# Altium schematic sheet Sheet1.SchDoc
size 431 x 279 mm; SheetNumber: 1; SheetTotal: 1
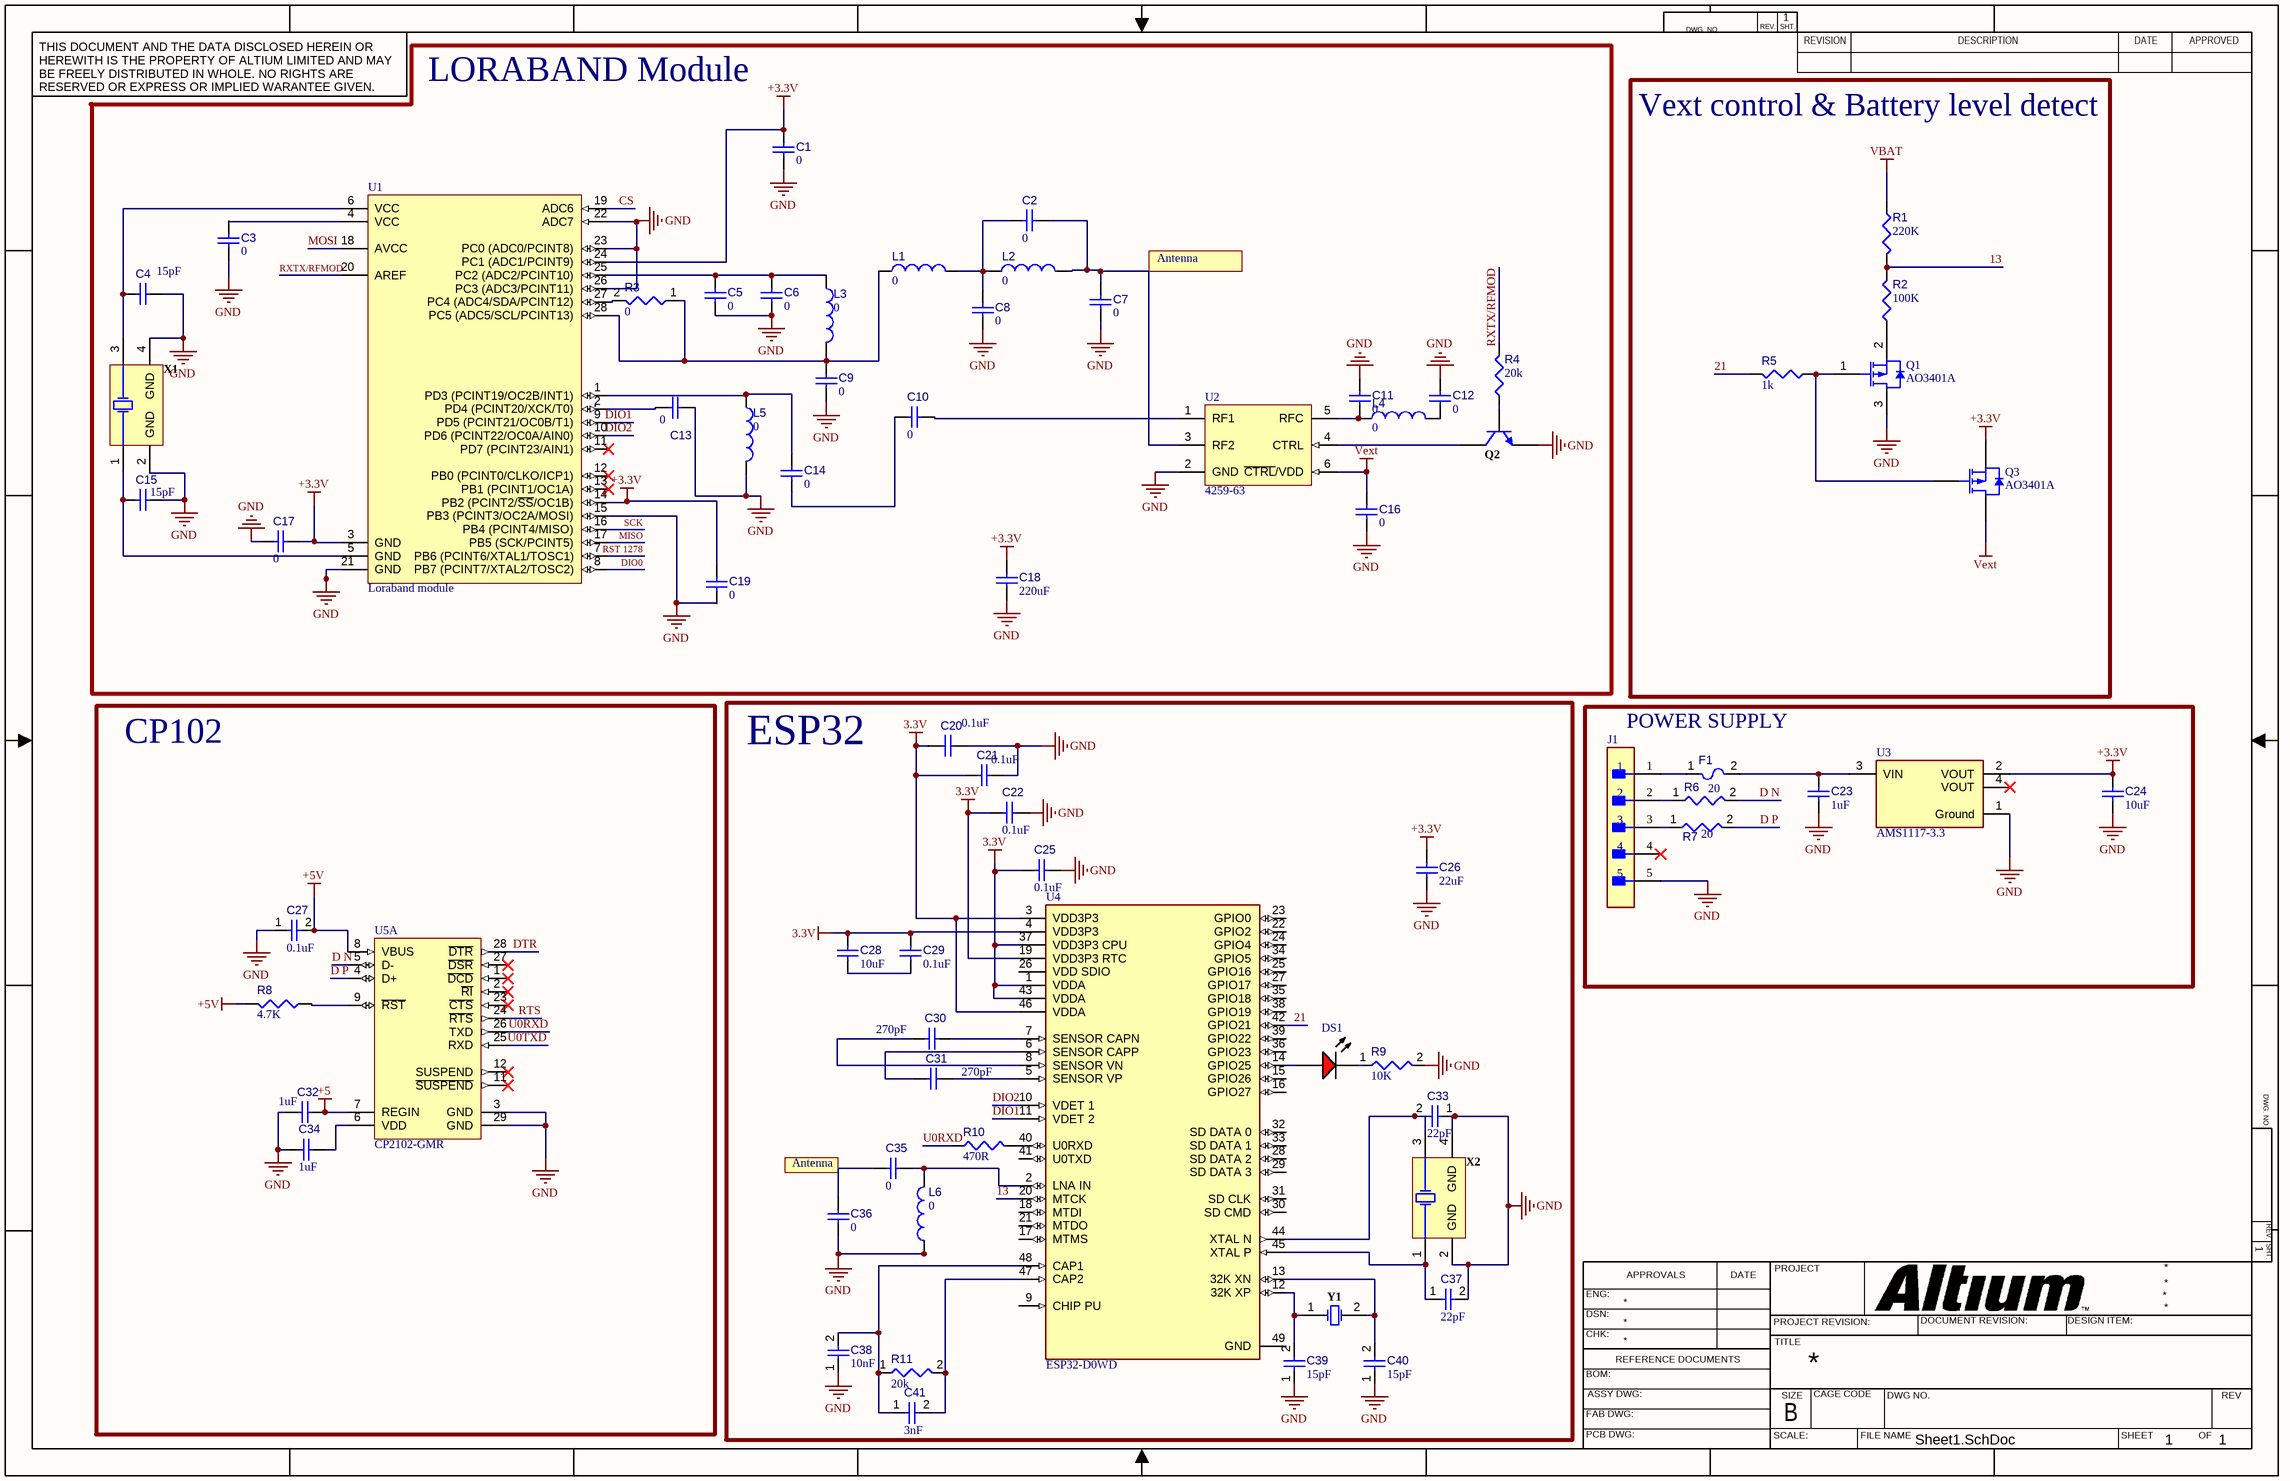
[diagram p0: Sheet1.SchDoc]

## Parts
C1  value 0  [CAPC0402(1005)60_L]  (hidden comment: Capacitor 10nF +/-20% 50V 0402)
C2  value 0  [CAPC0402(1005)60_L]  (hidden comment: Capacitor 10nF +/-20% 50V 0402)
C3  value 0  [CAPC0402(1005)60_L]  (hidden comment: Capacitor 10nF +/-20% 50V 0402)
C4  value 15pF  [CAPC0402(1005)60_L]  (hidden comment: Capacitor 10nF +/-20% 50V 0402)
C5  value 0  [CAPC0402(1005)60_L]  (hidden comment: Capacitor 10nF +/-20% 50V 0402)
C6  value 0  [CAPC0402(1005)60_L]  (hidden comment: Capacitor 10nF +/-20% 50V 0402)
C7  value 0  [CAPC0402(1005)60_L]  (hidden comment: Capacitor 10nF +/-20% 50V 0402)
C8  value 0  [CAPC0402(1005)60_L]  (hidden comment: Capacitor 10nF +/-20% 50V 0402)
C9  value 0  [CAPC0402(1005)60_L]  (hidden comment: Capacitor 10nF +/-20% 50V 0402)
C10  value 0  [CAPC0402(1005)60_L]  (hidden comment: Capacitor 10nF +/-20% 50V 0402)
C11  value 0  [CAPC0402(1005)60_L]  (hidden comment: Capacitor 10nF +/-20% 50V 0402)
C12  value 0  [CAPC0402(1005)60_L]  (hidden comment: Capacitor 10nF +/-20% 50V 0402)
C13  value 0  [CAPC0402(1005)60_L]  (hidden comment: Capacitor 10nF +/-20% 50V 0402)
C14  value 0  [CAPC0402(1005)60_L]  (hidden comment: Capacitor 10nF +/-20% 50V 0402)
C15  value 15pF  [CAPC0402(1005)60_L]  (hidden comment: Capacitor 10nF +/-20% 50V 0402)
C16  value 0  [CAPC0402(1005)60_L]  (hidden comment: Capacitor 10nF +/-20% 50V 0402)
C17  value 0  [CAPC0402(1005)60_L]  (hidden comment: Capacitor 10nF +/-20% 50V 0402)
C18  value 220uF  [CAPC0402(1005)60_L]  (hidden comment: Capacitor 10nF +/-20% 50V 0402)
C19  value 0  [CAPC0402(1005)60_L]  (hidden comment: Capacitor 10nF +/-20% 50V 0402)
C20  value 0.1uF  [CAPC0402(1005)60_L]  (hidden comment: Capacitor 10nF +/-20% 50V 0402)
C21  value 0.1uF  [CAPC0402(1005)60_L]  (hidden comment: Capacitor 10nF +/-20% 50V 0402)
C22  value 0.1uF  [CAPC0402(1005)60_L]  (hidden comment: Capacitor 10nF +/-20% 50V 0402)
C23  value 1uF  [CAPC0402(1005)60_L]  (hidden comment: Capacitor 10nF +/-20% 50V 0402)
C24  value 10uF  [CAPC0402(1005)60_L]  (hidden comment: Capacitor 10nF +/-20% 50V 0402)
C25  value 0.1uF  [CAPC0402(1005)60_L]  (hidden comment: Capacitor 10nF +/-20% 50V 0402)
C26  value 22uF  [CAPC0402(1005)60_L]  (hidden comment: Capacitor 10nF +/-20% 50V 0402)
C27  value 0.1uF  [CAPC0402(1005)60_L]  (hidden comment: Capacitor 10nF +/-20% 50V 0402)
C28  value 10uF  [CAPC0402(1005)60_L]  (hidden comment: Capacitor 10nF +/-20% 50V 0402)
C29  value 0.1uF  [CAPC0402(1005)60_L]  (hidden comment: Capacitor 10nF +/-20% 50V 0402)
C30  value 270pF  [CAPC0402(1005)60_L]  (hidden comment: Capacitor 10nF +/-20% 50V 0402)
C31  value 270pF  [CAPC0402(1005)60_L]  (hidden comment: Capacitor 10nF +/-20% 50V 0402)
C32  value 1uF  [CAPC0402(1005)60_L]  (hidden comment: Capacitor 10nF +/-20% 50V 0402)
C33  value 22pF  [CAPC0402(1005)60_L]  (hidden comment: Capacitor 10nF +/-20% 50V 0402)
C34  value 1uF  [CAPC0402(1005)60_L]  (hidden comment: Capacitor 10nF +/-20% 50V 0402)
C35  value 0  [CAPC0402(1005)60_L]  (hidden comment: Capacitor 10nF +/-20% 50V 0402)
C36  value 0  [CAPC0402(1005)60_L]  (hidden comment: Capacitor 10nF +/-20% 50V 0402)
C37  value 22pF  [CAPC0402(1005)60_L]  (hidden comment: Capacitor 10nF +/-20% 50V 0402)
C38  value 10nF  [CAPC0402(1005)60_L]  (hidden comment: Capacitor 10nF +/-20% 50V 0402)
C39  value 15pF  [CAPC0402(1005)60_L]  (hidden comment: Capacitor 10nF +/-20% 50V 0402)
C40  value 15pF  [CAPC0402(1005)60_L]  (hidden comment: Capacitor 10nF +/-20% 50V 0402)
C41  value 3nF  [CAPC0402(1005)60_L]  (hidden comment: Capacitor 10nF +/-20% 50V 0402)
DS1  TLMS1100-GS08  [VISH-TLMX1100_V]  (value not drawn)
F1  MF-MSMF050  [BOUR-MF-MSMF050-2_V]  (value not drawn)
J1  22-28-4050  [FP-22-28-4050-MFG]  (value not drawn)
L1  value 0  [SUSUMU-PCMB063T_V]  (hidden comment: PCMB063T-2R2MS)
L2  value 0  [SUSUMU-PCMB063T_V]  (hidden comment: PCMB063T-2R2MS)
L3  value 0  [SUSUMU-PCMB063T_V]  (hidden comment: PCMB063T-2R2MS)
L4  value 0  [SUSUMU-PCMB063T_V]  (hidden comment: PCMB063T-2R2MS)
L5  value 0  [SUSUMU-PCMB063T_V]  (hidden comment: PCMB063T-2R2MS)
L6  value 0  [SUSUMU-PCMB063T_V]  (hidden comment: PCMB063T-2R2MS)
Q1  AO3401A  [AO-SOT-23-3L_V]
Q2  2SC3356-T1B-A  [RENE-2SC3356-A-3_N]  (value not drawn)
Q3  AO3401A  [AO-SOT-23-3L_V]
R1  value 220K  [RESC1609X50X30ML08T20]  (hidden comment: Resistor 22R +/-1% 0603 100 mW)
R2  value 100K  [RESC1609X50X30ML08T20]  (hidden comment: Resistor 22R +/-1% 0603 100 mW)
R3  value 0  [RESC1609X50X30ML08T20]  (hidden comment: Resistor 22R +/-1% 0603 100 mW)
R4  value 20k  [RESC1609X50X30ML08T20]  (hidden comment: Resistor 22R +/-1% 0603 100 mW)
R5  value 1k  [RESC1609X50X30ML08T20]  (hidden comment: Resistor 22R +/-1% 0603 100 mW)
R6  value 20  [RESC1609X50X30ML08T20]  (hidden comment: Resistor 22R +/-1% 0603 100 mW)
R7  value 20  [RESC1609X50X30ML08T20]  (hidden comment: Resistor 22R +/-1% 0603 100 mW)
R8  value 4.7K  [RESC1609X50X30ML08T20]  (hidden comment: Resistor 22R +/-1% 0603 100 mW)
R9  value 10K  [RESC1609X50X30ML08T20]  (hidden comment: Resistor 22R +/-1% 0603 100 mW)
R10  value 470R  [RESC1609X50X30ML08T20]  (hidden comment: Resistor 22R +/-1% 0603 100 mW)
R11  value 20k  [RESC1609X50X30ML08T20]  (hidden comment: Resistor 22R +/-1% 0603 100 mW)
U1  Loraband module  [32A_L]
U2  4259-63  [PERE-SC-70-6_M]
U3  AMS1117-3.3  [FP-AMS1117-IPC_C]
U4  ESP32-D0WD  [FP-ESP32-D0WD-IPC_C]
U5  CP2102-GMR  [SLAB-QFN-28-3125x3125TP_M]  (part A of 2)
X1  7B-24.000MAAJ-T  [TXC-7B-4_V]  (value not drawn)
X2  7B-40.000MAAJ-T  [TXC-7B-4_V]  (value not drawn)
Y1  9HT10-32.768KDZF-T  [TXC-9HT10_V]  (value not drawn)

## Blocks framed on the sheet
LORABAND Module: C1-C19 L1-L5 Q2 R3 R4 U1 U2 X1
Vext control & Battery level detect: Q1 Q3 R1 R2 R5
CP102: C27 C32 C34 R8 U5
ESP32: C20-C22 C25 C26 C28-C31 C33 C35-C41 DS1 L6 R9-R11 U4 X2 Y1
POWER SUPPLY: C23 C24 F1 J1 R6 R7 U3

## Nets
3.3V: C20.1 C21.1 C22.1 C25.1 C28.1 C29.1 U4.1(VDDA) U4.3(VDD3P3) U4.4(VDD3P3) U4.19(VDD3P3_RTC) U4.37(VDD3P3_CPU) U4.43(VDDA) U4.46(VDDA)
+3.3V: C1.1 C17.1 C18.2 C19.2 C24.1 C26.2 Q3.2(SOURCE) U1.3(GND) U1.14(PB2_(PCINT2/~{SS}/OC1B)) U1.24(PC1_(ADC1/PCINT9)) U3.2(VOUT)
+5: C32.2 U5.7(REGIN)
+5V: C27.2 R8.2 U5.8(VBUS)
GND: C1.2 C3.1 C4.2 C5.1 C6.1 C7.1 C8.1 C9.1 C11.1 C12.1 C13.2 C15.2 C16.2 C17.2 C18.1 C19.1 C20.2 C21.2 C22.2 C23.2 C24.2 C25.2 C26.1 C27.1 C32.1 C33.1 C34.1 C36.1 C37.2 C38.1 C39.1 C40.1 J1.5 L5.2 L6.1 Q1.3(DRAIN) Q2.1(Emitter) R9.2 U1.15(PB3_(PCINT3/OC2A/MOSI)) U1.21(GND) U1.22(ADC7) U1.23(PC0_(ADC0/PCINT8)) U1.26(PC3_(ADC3/PCINT11)) U2.2(GND) U3.1(Ground) U5.3(GND) U5.29(GND) X1.2(GND) X1.4(GND) X2.2(GND) X2.4(GND)
VBAT: R1.1
Vext: C16.1 Q3.3(DRAIN) U2.6(~{CTRL}/VDD)
13: R1.2 R2.2 U4.20(MTCK)
21: R5.2 U4.42(GPIO21)
CS: U1.19(ADC6)
D N: R6.2 U5.5(D-)
D P: R7.2 U5.4(D+)
DIO0: U1.8(PB7_(PCINT7/XTAL2/TOSC2))
DIO1: U1.9(PD5_(PCINT21/OC0B/T1)) U4.11(VDET_2)
DIO2: U1.10(PD6_(PCINT22/OC0A/AIN0)) U4.10(VDET_1)
DTR: U5.28(~{DTR})
MISO: U1.17(PB5_(SCK/PCINT5))
MOSI: U1.18(AVCC)
RST 1278: U1.7(PB6_(PCINT6/XTAL1/TOSC1))
RTS: U5.24(~{RTS})
RXTX/RFMOD: R4.2 U1.20(AREF)
SCK: U1.16(PB4_(PCINT4/MISO))
U0RXD: R10.1 U5.26(TXD)
U0TXD: U5.25(RXD)
NetC2_1: C2.1 C7.2 L2.2 U2.3(RF2)
NetC2_2: C2.2 C8.2 L1.2 L2.1
NetC3_2: C3.2 U1.4(VCC)
NetC4_1: C4.1 U1.6(VCC) X1.3(X2)
NetC5_2: C5.2 C6.2 L3.1 U1.25(PC2_(ADC2/PCINT10))
NetC9_2: C9.2 L1.1 L3.2 R3.1 U1.28(PC5_(ADC5/SCL/PCINT13))
NetC10_1: C10.1 U2.1(RF1)
NetC10_2: C10.2 C14.1
NetC11_2: C11.2 L4.1 U2.5(RFC)
NetC12_2: C12.2 L4.2
NetC13_1: C13.1 U1.2(PD4_(PCINT20/XCK/T0))
NetC14_2: C14.2 L5.1 U1.1(PD3_(PCINT19/OC2B/INT1))
NetC15_1: C15.1 U1.5(GND) X1.1(X1)
NetC23_1: C23.1 F1.2 U3.3(VIN)
NetC28_2: C28.2 C29.2
NetC30_1: C30.1 U4.8(SENSOR_VN)
NetC30_2: C30.2 U4.7(SENSOR_CAPN)
NetC31_1: C31.1 U4.6(SENSOR_CAPP)
NetC31_2: C31.2 U4.5(SENSOR_VP)
NetC33_2: C33.2 U4.44(XTAL_N) X2.3(X2)
NetC34_2: C34.2 U5.6(VDD)
NetC35_1: C35.1 L6.2 U4.2(LNA_IN)
NetC35_2: C35.2 C36.2
NetC37_1: C37.1 U4.45(XTAL_P) X2.1(X1)
NetC38_2: C38.2 C41.1 R11.1 U4.48(CAP1)
NetC39_2: C39.2 U4.12(32K_XP) Y1.1
NetC40_2: C40.2 U4.13(32K_XN) Y1.2
NetC41_2: C41.2 R11.2 U4.47(CAP2)
NetDS1_1: DS1.1(A) U4.14(GPIO25)
NetDS1_2: DS1.2(K) R9.1
NetF1_1: F1.1 J1.1
NetJ1_2: J1.2 R6.1
NetJ1_3: J1.3 R7.1
NetQ1_1: Q1.1(GATE) Q3.1(GATE) R5.1
NetQ1_2: Q1.2(SOURCE) R2.1
NetQ2_2: Q2.2(Base) R4.1
NetQ2_3: Q2.3(Collector) U2.4(CTRL)
NetR3_2: R3.2 U1.27(PC4_(ADC4/SDA/PCINT12))
NetR8_1: R8.1 U5.9(~{RST})
NetR10_2: R10.2 U4.40(U0RXD)

Not connected (* = marked no-connect by the designer): J1 4*; U1 11(PD7_(PCINT23/AIN1))* 12(PB0_(PCINT0/CLKO/ICP1))* 13(PB1_(PCINT1/OC1A))*; U3 4(VOUT)*; U4 9(CHIP_PU) 15(GPIO26) 16(GPIO27) 17(MTMS) 18(MTDI) 21(MTDO) 22(GPIO2) 23(GPIO0) 24(GPIO4) 25(GPIO16) 26(VDD_SDIO) 27(GPIO17) 28(SD_DATA_2) 29(SD_DATA_3) 30(SD_CMD) 31(SD_CLK) 32(SD_DATA_0) 33(SD_DATA_1) 34(GPIO5) 35(GPIO18) 36(GPIO23) 38(GPIO19) 39(GPIO22) 41(U0TXD) 49(GND); U5 1(~{DCD})* 2(~{RI})* 11(~{SUSPEND})* 12(SUSPEND)* 23(~{CTS})* 27(~{DSR})*

## Notes on the sheet
- Antenna
- DWG. NO.
- REV.
- SHT.
- THIS DOCUMENT AND THE DATA DISCLOSED HEREIN OR HEREWITH IS THE PROPERTY OF ALTIUM LIMITED AND MAY BE FREELY DISTRIBUTED IN WHOLE. NO RIGHTS ARE RESERVED OR EXPRESS OR IMPLIED WARANTEE GIVEN.
- REVISION
- DESCRIPTION
- DATE
- APPROVED
- ENG:
- APPROVALS
- PROJECT
- DSN:
- CHK:
- REFERENCE DOCUMENTS
- PROJECT REVISION:
- TITLE
- DOCUMENT REVISION:
- DESIGN ITEM:
- BOM:
- FAB DWG:
- PCB DWG:
- ASSY DWG:
- SCALE:
- SIZE
- B
- CAGE CODE
- FILE NAME
- DWG NO.
- SHEET
- OF
- REV

## Library data of the parts
C1-C41 = CMP-001-00069-3: Chip Capacitor, 10nF +/-20%, 50V, 0402, Thickness 0.6 mm; Tolerance: 5%; Max Operating Temperature: 85°C; Pins: 2; Case/Package: 0402; Voltage Rating: 50V; Min Operating Temperature: -55°C; Mounting Technology: SMT
DS1 = CMP-007-00030-2: Red Led, 20mA, 2.1 V, -40 to 100 degC, 2-Pin SMD (0603), RoHS, Tape and Reel; Manufacturer: Vishay Semiconductor; Viewing Angle: 160degrees; Forward Voltage: 2.1V; Lens Style: Clear; Power: 90mW; Luminous Intensity: 63mcd; Datasheet Version: Rev. 2.7, 03/2016; Package Quantity: 3000; Colour: Red; Package Description: 2-Pin Surface Mount Device, Body 1.6 x 0.8 mm; Datasheet URL: http://www.vishay.com/docs/83173/tlmb1100.pdf; Package Reference: TLMX1100; Max Operating Temperature: 100°C; Mounting Technology: SM; Packaging: TapeandReel; Case/Package: 0603; Illumination Colour: Red; Forward Current: 20mA; Manufacturer URL: http://www.vishay.com/; RoHS Compliant: True; Min Operating Temperature: -40°C; Nominal Vf: 2.1V; Pins: 2
F1 = CMP-005-00000-3: PTC Resettable Fuse, 15 V, 500 mA, -40 to 85 degC, 2-Pin SMD, RoHS, Tape and Reel; Manufacturer: Bourns; Current Rating: 100A; Case/Package: MF-MSMF050-2; Package Reference: MF-MSMF050-2; Package Description: 2-Pin Surface Mount Device, Body 4.55 x 3.24 mm; Mounting Technology: SM; Datasheet Version: Rev. AG, 08/2016; Min Operating Temperature: -40°C; Max Operating Temperature: 85°C; RoHS Compliant: False; Packaging: TapeandReel; Datasheet URL: http://www.bourns.com/data/global/pdfs/mfmsmf.pdf
J1 = CMP-00257-00278173-1: 22-28-4050 KK® 254 Breakaway Header, Vertical, 5 Circuits, Tin (Sn) Plating, Mating Pin Length 6.09mm; NexarPartId: 278173; Voltage Rating: 250V; Number of Contacts: 5; Contact Resistance: 20mΩ; Gender: Male; Pitch: 2.54mm; Connector Type: Male Pin; Current Rating: 4A; Glow Wire Compliant: Non-compliant; Max Voltage Rating (DC): 250.25kV; Flammability Rating: UL94 V-0; Min Operating Temperature: 0°C; REACH SVHC: Unknown; Lead Free: Lead Free; Termination: Solder; RoHS: Compliant; Schedule B: 8536694040; Number of Circuits: 5; Mount: Through Hole; Lead Pitch: 2.54mm; Height: 2.29mm; Voltage Rating (DC): 250V; Max Operating Temperature: 75°C; Width: 2.49mm; Radiation Hardening: No; Contact Plating: Tin; Orientation: Vertical; Length: 12.7mm; Number of Rows: 1; Housing Material: Thermoplastic; Contact Material: Brass; Packaging: Bulk; Contact Mating Length: 6.096mm; Housing Color: Black; Color: Black; Number of Positions: 5
L1-L6 = CMP-006-00019-3: Shielded Wirewound Inductor, 2.2 uH, +/- 20%, -20 to 120 degC, 2-Pin SMD, RoHS, Tape and Reel; Case/Package: SMD/SMT; Pins: 2; Tolerance: 20%
Q1 Q3 = CMP-2000-05778-1: P-Channel MOSFET, 30 V, 4 A, -55 to 150 degC, 3-Pin SOT-23-3L, RoHS, Tape and Reel; Manufacturer: Alpha and Omega; Output Power (Max): NotRequiredW; Power Dissipation: 1.4W; Rad Hardened: No; Drain Efficiency: NotRequired%; Drain-Source On-Volt: 30V; Noise Figure: NotRequireddB; Frequency (Max): NotRequiredMHz; Number of  Elements: 1; Gate-Source Voltage (Max): ?12V; Drain Current (Max): 4A; Channel Mode: Enhancement; Drain-Source On-Res: 0.044ohm; Type: PowerMOSFET; Polarity: P; Package URL: http://www.aosmd.com/res/packaging_information/SOT-23-3L.pdf; Datasheet URL: http://www.aosmd.com/res/data_sheets/AO3401A.pdf; Package Type: SOT-23; Package Description: 3-Pin Small Outline Transistor, Body 2.95 x 1.6 mm, Pitch 0.95 mm; Mounting: SurfaceMount; Manufacturer URL: http://www.aosmd.com/; Continuous Drain Current: 4A; Package Reference: SOT-23-3L; Mounting Technology: SurfaceMount; Operating Temperature Classification: Military; Power Gain: NotRequireddB; Datasheet Version: Rev. 3, 03/2011; Operating Temp Range: -55Cto150C; Pin Count: 3
Q2 = CMP-0566-00002-2: 1GHz NPN Epitaxial Silicon RF Transistor for Microwave Low-Noise Amplification, 12 V, 3 MM Package, Pb-Free; Manufacturer: Renesas; VCEO (V): 12; Ic (A): 0.1; f at NF (GHz): 1; hFE max.: 250; NF (dB) typ.: 1.1; hFE min.: 50; fT (GHz) typ.: 7; DatasheetVersion: Rev. 3.00; PackageReference: 2SC3356-3; ComponentLink2URL: http://documentation.renesas.com/doc/YOUSYS/document/r09ds0021ej0300_microwave.pdf; NPN/PNP: NPN; ComponentLink3URL: http://documentation.renesas.com/doc/YOUSYS/document/r09ds0021ej0300_microwave.pdf; ComponentLink3Description: Package Specification; PartNumber: 2SC3356-T1B-A; Mounting Technology: Surface Mount; PackageDescription: 3-Pin Minimold Package, Body 1.5 x 2.9 mm, Pitch 0.95 mm; ComponentLink1URL: http://www.renesas.eu/; ComponentLink2Description: Datasheet; ComponentLink1Description: Manufacturer URL
R1-R11 = CMP-009-00027-5: Chip Resistor, 22 Ohm, +/- 1%, 100 mW, -55 to 155 degC, 0603 (1608 Metric); Power: 100mW; Voltage Rating: 75V; Max Operating Temperature: 155°C; Min Operating Temperature: -55°C; Tolerance: 1%; RoHS Compliant: True; Mounting Technology: SM; Case/Package: 0603; Pins: 2
U1 = CMP-0095-00261-2: 8-bit AVR Microcontroller, 32KB Flash, 1KB EEPROM, 2KB SRAM, 32-pin TQFP, Industrial Grade (-40°C to 85°C); DatasheetVersion: revD, May-2011; ComponentLink3Description: ATmega48A/48PA/88A/88PA/168A/168PA/328/328P Summary; Code_JEDEC: MS-026-ABA; ComponentLink1URL: http://www.atmel.com/; RevisionNote: DatasheetVersion & PackageVersion updated. URLs added.; ComponentLink2Description: ATmega48A/48PA/88A/88PA/168A/168PA/328/328P Datasheet; ComponentLink1Description: Manufacturer URL; ComponentLink2URL: http://www.atmel.com/dyn/resources/prod_documents/doc8271.pdf; PackageReference: 32A; ComponentLink3URL: http://www.atmel.com/dyn/resources/prod_documents/8271S.pdf; PackageDescription: 32-Lead, 7x7x1.0 mm Body, 0.8mm Lead Pitch, Thin Profile Plastic Quad Flat Package (TQFP); PackageVersion: revC, Oct-2010
U2 = CMP-2000-05298-1: IC RF Switch SPDT, 50 Ohm, 6-Pin SC70, RoHS, Tape and Reel; Manufacturer: Peregrine Semiconductor; P1dB: 29dBm(typ)IP1dB; Topology: Reflective; Frequency - Upper: 3GHz; Insertion Loss @ Frequency: 0.5dB@2GHz; IIP3: 55dBm(typ); Voltage - Supply: 1.8V~3.3V; Other Names: 1046-1011-24259-63-ND425963PE4259PE4259SCBC-ZPE4259SCBC-Z-ND; Isolation @ Frequency: 20dB@2GHz(typ); Frequency - Lower: 10MHz; Online Catalog: PE4259; Impedance: 50Ohm; RF Type: GeneralPurpose; Series: UltraCMOS; Manufacturer URL: http://www.psemi.com/; Package Description: 6-Pin Small Outline Transistor, Body 2.05 x 1.25 mm, Pitch 0.65 mm; Family: RFSwitches; Packaging: Tape&Reel(TR); Features: Single/DualLineControl; Package / Case: 6-TSSOP,SC-88,SOT-363; Operating Temperature: -40degC~85degC; Circuit: SPDT; Supplier Device Package: SC-70-6; Standard Package: 3,000; Datasheet URL: https://datasheet.ciiva.com/15100/getdatasheetpartid-685660-15100501.pdf; Category: RF/IFandRFID; Datasheet Version: Jan-11; Package Reference: SC-70-6
U3 = CMP-209535-000001-1: LDO Voltage Regulators 1A, 3.3V; Manufacturer: Advanced Monolithic Systems; Dropout Voltage: 1.1V; Output Type: Fixed; Nominal Supply Current: 5mA; Max Power Dissipation: 1.2W; Max Supply Voltage: 15V; Number Of Outputs: 1; Standoff Height: 0.64mm; Max Junction Temp: +125°C; Height: 1.8mm; Package: AMS1117; Device Class L2: Power Management ICs; ComponentLink2Description: Datasheet; ComponentLink2URL: http://www.advanced-monolithic.com/pdf/ds1117.pdf; Category: IC; RoHS: TRUE; Automotive: No; Device Class L1: Integrated Circuits (ICs); Output Current: 1A; Device Class L3: Voltage Regulators - Linear; Temperature: -40°C to +125°C; Output Voltage: 3.3V; Manufacturer Part Number: AMS1117-3.3; Temperature Range Low: -40°C; Octopart: https://octopart.com/ams1117-3.3-advanced+monolithic+systems-25899300; Lead Free: Yes; Ipc Land Pattern Name: SOT229P700X180-4; Temperature Range High: +125°C
U4 = CMP-194065-000002-1: IC RF TXRX+MCU BLUETOOTH 48VFQFN; Manufacturer: Espressif; Max Frequency: 2484MHz; Max Supply Voltage: 3.6V; Interface: I2C,SPI,UART,CAN,Ethernet,I2S,Other; Receiving Current: 100mA; Min Supply Voltage: 1.8V; Data Rate: 150Mbits/s; Number Of Gpio: 34; Bandwidth: 2412-2484MHz; Nominal Supply Current: 0.5A; Sensitivity: -70dBm; Number Of Adc Channels: 18; Transmitting Current: 240mA; Standoff Height: 0mm; Manufacturer Part Number: ESP32-D0WD; Device Class L3: Transceivers; Ipc Land Pattern Name: QFN35P500X500X85-48; Category: IC; Device Class L2: RF Semiconductors and Devices; Device Class L1: Integrated Circuits (ICs); Digikey Description: IC RF TXRX+MCU BLUETOOTH 48VFQFN; ComponentLink2URL: https://www.espressif.com/sites/default/files/documentation/esp32_datasheet_en.pdf; Temperature Range Low: -40°C; Mouser Description: SMD IC ESP32-D0WD, Dual Core Mcu, Wifi & Bluetooth Combo, QFN48-PIN, 5*5MM; Height: 0.9mm; Octopart: https://octopart.com/esp32-d0wd-espressif+systems-89169964; Automotive: No; ComponentLink2Description: Datasheet; Temperature: -40°C to +125°C; Lead Free: Yes; Temperature Range High: +125°C; RoHS: TRUE; Package: ESP32-D0WD
U5 = CMP-2000-04924-1: Single-Chip USB to URAT Bridge, 3.3 V, -40 to 85 degC, 28-Pin QFN, RoHS, Tape and Reel; Manufacturer: Silicon Labs; Interface Circuit Standard 1: RS-232; Transmitter and Receiver FIFO Counter: No; Supply Current: 26mA; Operating Supply Voltage (Min): 3V; Operating Supply Voltage (Typ): 3.3V; Data Rate: 1000kbps; Operating Supply Voltage (Max): 3.6V; Number of Channels: 1; Package URL: http://www.silabs.com/Support%20Documents/TechnicalDocs/C8051T61x.pdf; Operating Temperature (Max): 85C; Datasheet URL: http://www.mouser.com/ds/2/368/CP2102-9-247052.pdf; Operating Temperature Classification: Industrial; Operating Temperature (Min): -40C; Package Description: 28-Pin Quad-Flat No-Leads Package, Body 5 x 5 mm, Pitch 0.5 mm; Manufacturer URL: http://www.silabs.com/; Rad Hardened: No; Package Reference: QFN-28; Pin Count: 28; Packaging: TapeandReel; Mounting: SurfaceMount; Package Type: QFNEP; Datasheet Version: Rev. 1.6, 12/2013
X1 = CMP-003-00011-2: SMD Seam Sealing Crystal, 24 MHz, +/- 30 ppm, 18 pF, -10 to 70 degC, 4-Pin SMD, RoHS, Tape and Reel; Manufacturer: TXC; Resistance: 40Ohm; Frequency: 24MHz; Tolerance: 30ppm; ESR: 40; Load Capacitance: 18pF; Package Description: 4-Pin Surface Mount Device, Body 5 x 3.2 mm, Pitch 3.7 mm; Pins: 4; Mounting Technology: SM; Package Reference: 7B-4; Max Operating Temperature: 70°C; Package Quantity: 1000; Min Operating Temperature: -20°C; Datasheet URL: http://www.txccorp.com/download/products/quartz_crystals/2015TXC_7B_19.pdf; RoHS Compliant: True; Datasheet Version: Jul-15; Case/Package: 7B-4; Packaging: TapeandReel; Frequency Tolerance: 30ppm
X2 = CMP-003-00012-2: 9B Series Quartz Crystal, 40 MHz, +/-30 ppm, 18 pF, -40 to 85 degC, 4-Pin SMD, RoHS, Tape and Reel; Manufacturer: TXC; Tolerance: 30ppm; Resistance: 40Ohm; ESR: 40; Frequency: 40MHz; Load Capacitance: 18pF; Package Quantity: 1; RoHS Compliant: True; Case/Package: 7B-4; Datasheet Version: Jan-10; Packaging: TapeandReel; Package Description: 4-Pin Surface Mount Device, Body 5 x 3.2 mm, Pitch 3.7 mm; Frequency Tolerance: 30ppm; Pins: 4; Datasheet URL: http://www.txccrystal.com/images/pdf/7b.pdf; Max Operating Temperature: 70°C; Min Operating Temperature: -20°C; Mounting Technology: SM; Package Reference: 7B-4; Parameter 1: *
Y1 = CMP-003-00014-2: Tuning Fork, 32.768 KHz, +/-20 ppm, 12.5 pF, -40 to 85 degC, 2-Pin SMD, RoHS, Tape and Reel; Manufacturer: TXC; Load Capacitance: 12.5pF; Tolerance: 20ppm; Resistance: 70000Ohm; ESR: 70k; Package Reference: 9HT10; Frequency: 32.768kHz; Package Description: 2-Pin Surface Mount Device, Body 3.2 x 1.5 mm; Case/Package: 9HT10; Max Operating Temperature: 85°C; RoHS Compliant: True; Frequency Tolerance: 20ppm; Package Quantity: 1; Datasheet URL: http://www.txccrystal.com/images/pdf/9ht10.pdf; Pins: 2; Datasheet Version: Jun-11; Mounting Technology: SM; Packaging: TapeandReel; Min Operating Temperature: -40°C